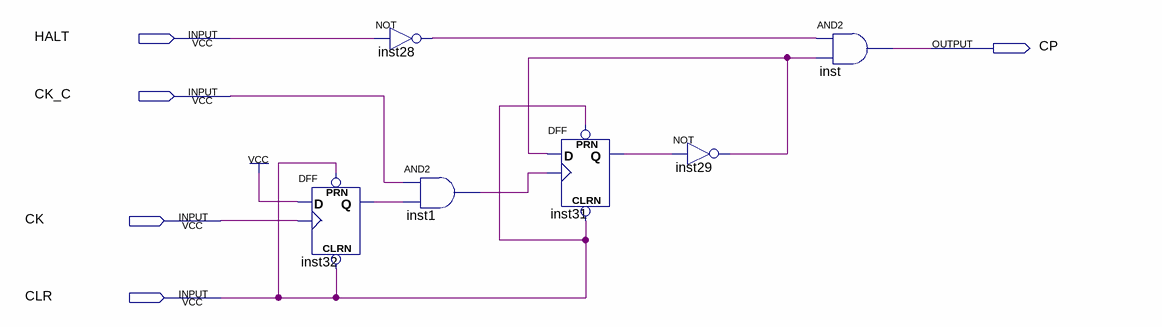
[diagram p0: schematic sheet]
// Quartus schematic start.bdf as structural Verilog: 6 symbols, 5 pins
module start (
  input  HALT,
  input  CK_C,
  input  CK,
  input  CLR,
  output CP
);

  wire inst1_out, inst28_out, inst29_out, inst31_q, inst32_q;

  DFF inst32 (.CLRN(CLR), .CLK(CK), .D(1'b1), .PRN(CLR), .Q(inst32_q));
  not inst28 (inst28_out, HALT);
  and inst1 (inst1_out, CK_C, inst32_q);
  DFF inst31 (.CLRN(CLR), .CLK(inst1_out), .D(inst29_out), .PRN(CLR), .Q(inst31_q));
  not inst29 (inst29_out, inst31_q);
  and inst (CP, inst28_out, inst29_out);
endmodule
